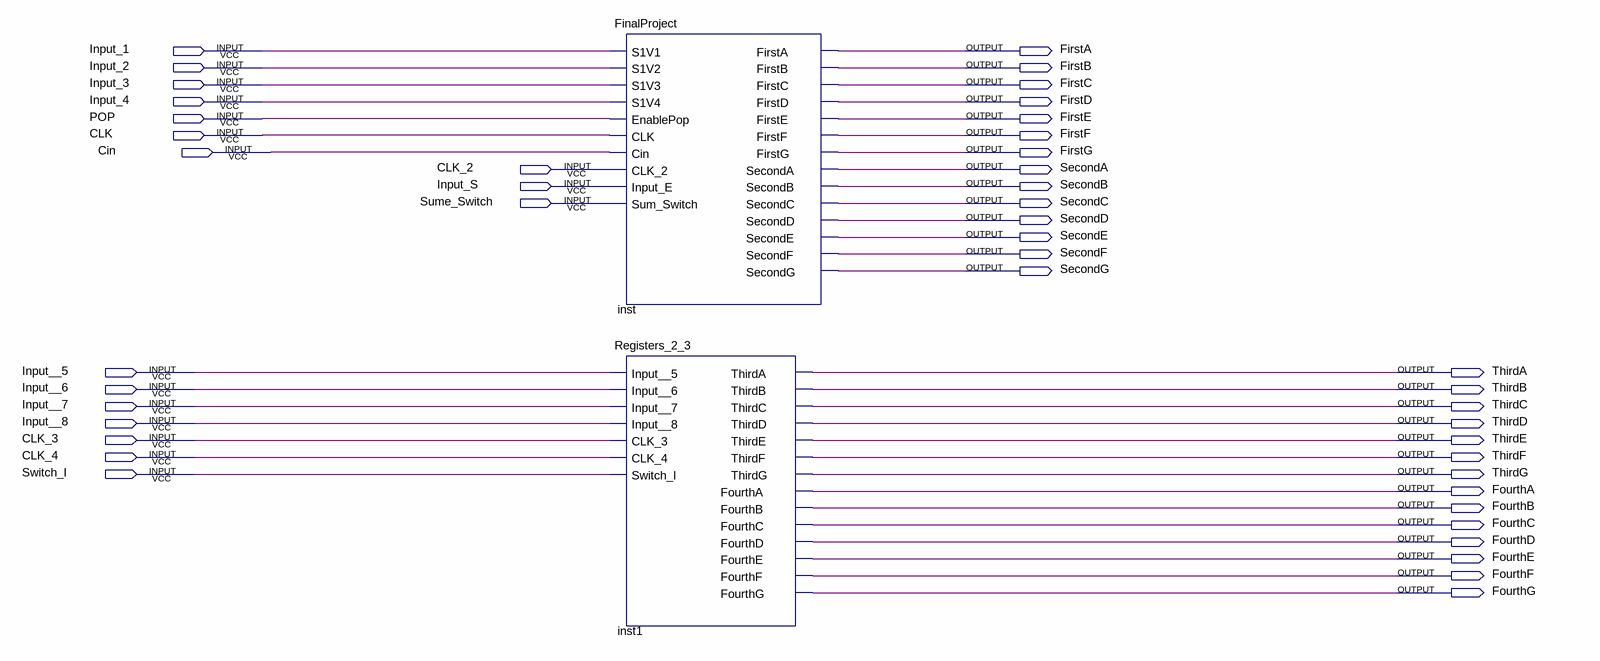
[diagram p0: schematic sheet]
// Quartus schematic Stack2.bdf as structural Verilog: 2 symbols, 45 pins
module Stack2 (
  input  Input_1,
  input  Input_2,
  input  Input_3,
  input  Input_4,
  input  POP,
  input  CLK,
  input  Cin,
  input  CLK_2,
  input  Input_S,
  input  Sume_Switch,
  input  Input__5,
  input  Input__6,
  input  Input__7,
  input  Input__8,
  input  CLK_3,
  input  CLK_4,
  input  Switch_I,
  output FirstA,
  output FirstB,
  output FirstC,
  output FirstD,
  output FirstE,
  output FirstF,
  output FirstG,
  output SecondA,
  output SecondB,
  output SecondC,
  output SecondD,
  output SecondE,
  output SecondF,
  output SecondG,
  output ThirdA,
  output ThirdB,
  output ThirdC,
  output ThirdD,
  output ThirdE,
  output ThirdF,
  output ThirdG,
  output FourthA,
  output FourthB,
  output FourthC,
  output FourthD,
  output FourthE,
  output FourthF,
  output FourthG
);

  FinalProject inst (
    .S1V1(Input_1), .S1V2(Input_2), .S1V3(Input_3), .S1V4(Input_4), .EnablePop(POP), .CLK(CLK), .Cin(Cin),
    .CLK_2(CLK_2), .Input_E(Input_S), .Sum_Switch(Sume_Switch), .FirstA(FirstA), .FirstB(FirstB),
    .FirstC(FirstC), .FirstD(FirstD), .FirstE(FirstE), .FirstF(FirstF), .FirstG(FirstG), .SecondA(SecondA),
    .SecondB(SecondB), .SecondC(SecondC), .SecondD(SecondD), .SecondE(SecondE), .SecondF(SecondF),
    .SecondG(SecondG));
  Registers_2_3 inst1 (
    .Input__5(Input__5), .Input__6(Input__6), .Input__7(Input__7), .Input__8(Input__8), .CLK_3(CLK_3),
    .CLK_4(CLK_4), .Switch_I(Switch_I), .ThirdA(ThirdA), .ThirdB(ThirdB), .ThirdC(ThirdC), .ThirdD(ThirdD),
    .ThirdE(ThirdE), .ThirdF(ThirdF), .ThirdG(ThirdG), .FourthA(FourthA), .FourthB(FourthB),
    .FourthC(FourthC), .FourthD(FourthD), .FourthE(FourthE), .FourthF(FourthF), .FourthG(FourthG));
endmodule
